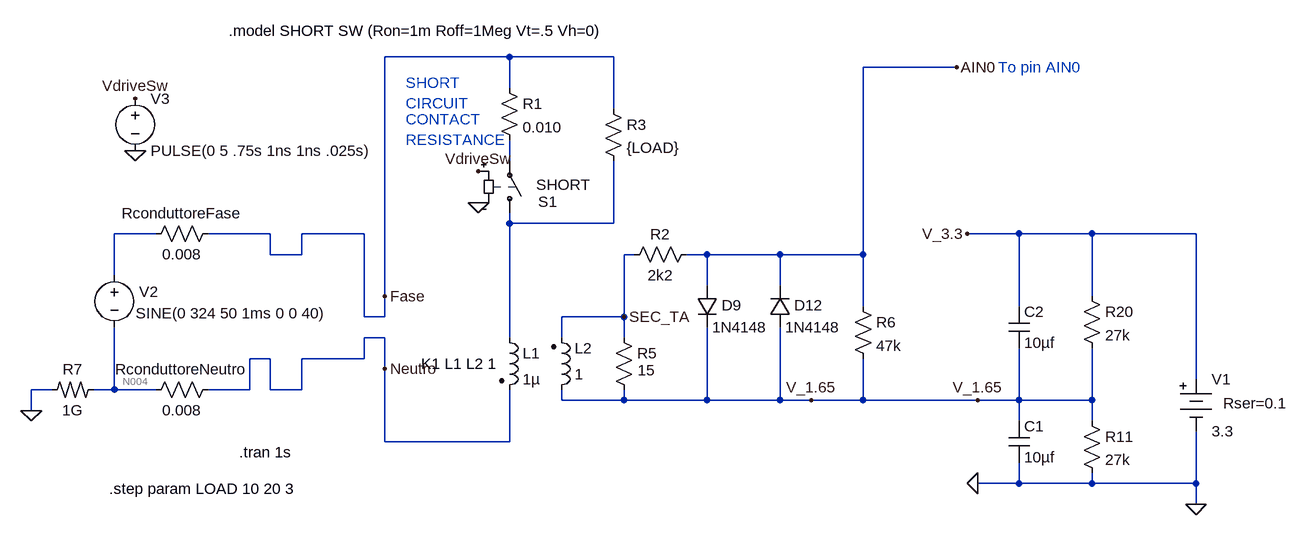
[diagram p0: schematic TrasfCurrentStudio.asc]
TrasfCurrentStudio.asc, the LTspice schematic file:
Version 4
SHEET 1 2288 680
WIRE 528 -464 336 -464
WIRE 688 -464 528 -464
WIRE 1216 -448 1072 -448
WIRE 528 -416 528 -464
WIRE 688 -384 688 -464
WIRE 528 -304 528 -336
WIRE 528 -208 528 -224
WIRE 688 -208 688 -304
WIRE 688 -208 528 -208
WIRE -16 -192 -80 -192
WIRE 160 -192 64 -192
WIRE 304 -192 208 -192
WIRE 1312 -192 1232 -192
WIRE 1424 -192 1312 -192
WIRE 1584 -192 1424 -192
WIRE 160 -160 160 -192
WIRE 208 -160 208 -192
WIRE 208 -160 160 -160
WIRE 720 -160 704 -160
WIRE 832 -160 800 -160
WIRE 944 -160 832 -160
WIRE 1072 -160 1072 -448
WIRE 1072 -160 944 -160
WIRE -80 -128 -80 -192
WIRE 832 -112 832 -160
WIRE 944 -112 944 -160
WIRE 336 -96 336 -464
WIRE 1424 -96 1424 -192
WIRE 1072 -80 1072 -160
WIRE 1312 -80 1312 -192
WIRE 304 -64 304 -192
WIRE 336 -64 336 -96
WIRE 336 -64 304 -64
WIRE 704 -64 704 -160
WIRE 704 -64 608 -64
WIRE 336 -32 304 -32
WIRE 528 -32 528 -208
WIRE 608 -32 608 -64
WIRE 704 -32 704 -64
WIRE 160 0 128 0
WIRE 304 0 304 -32
WIRE 304 0 208 0
WIRE 336 16 336 -32
WIRE 1584 32 1584 -192
WIRE -176 48 -208 48
WIRE -80 48 -80 -48
WIRE -80 48 -112 48
WIRE -16 48 -80 48
WIRE 128 48 128 0
WIRE 128 48 64 48
WIRE 160 48 160 0
WIRE 208 48 208 0
WIRE 208 48 160 48
WIRE 608 64 608 48
WIRE 704 64 704 48
WIRE 704 64 608 64
WIRE 832 64 832 -48
WIRE 832 64 704 64
WIRE 944 64 944 -48
WIRE 944 64 832 64
WIRE 992 64 944 64
WIRE 1072 64 1072 0
WIRE 1072 64 992 64
WIRE 1248 64 1072 64
WIRE 1312 64 1312 -16
WIRE 1312 64 1248 64
WIRE 1424 64 1424 -16
WIRE 1424 64 1312 64
WIRE -208 80 -208 48
WIRE 1312 96 1312 64
WIRE 1424 96 1424 64
WIRE 336 128 336 16
WIRE 528 128 528 48
WIRE 528 128 336 128
WIRE 1312 192 1312 160
WIRE 1312 192 1248 192
WIRE 1424 192 1424 176
WIRE 1424 192 1312 192
WIRE 1584 192 1584 112
WIRE 1584 192 1424 192
WIRE 1584 224 1584 192
FLAG 1232 -192 V_3.3
FLAG -208 80 0
FLAG 1584 224 0
FLAG 1216 -448 AIN0
FLAG 1248 64 V_1.65
FLAG 992 64 V_1.65
FLAG 1248 192 0
FLAG -48 -400 VdriveSw
FLAG -48 -320 0
FLAG 480 -288 VdriveSw
FLAG 480 -240 0
FLAG 336 -96 Fase
FLAG 336 16 Neutro
FLAG 704 -64 SEC_TA
SYMBOL battery 1584 16 R0
WINDOW 123 0 0 Left 0
WINDOW 39 42 53 Left 2
SYMATTR SpiceLine Rser=0.1
SYMATTR InstName V1
SYMATTR Value 3.3
SYMBOL res 688 -48 R0
WINDOW 3 37 66 Left 2
SYMATTR Value 15
SYMATTR InstName R5
SYMBOL ind2 512 -48 R0
SYMATTR InstName L1
SYMATTR Value 1µ
SYMATTR Type ind
SYMATTR SpiceLine Rser=1u
SYMBOL ind2 592 64 M180
WINDOW 0 36 80 Left 2
WINDOW 3 36 40 Left 2
SYMATTR InstName L2
SYMATTR Value 1
SYMATTR Type ind
SYMATTR SpiceLine Rser=47 Cpar=1pF
SYMBOL res2 -112 32 R90
WINDOW 0 0 32 VBottom 2
WINDOW 3 32 32 VTop 2
SYMATTR InstName R7
SYMATTR Value 1G
SYMBOL res 1408 -112 R0
SYMATTR InstName R20
SYMATTR Value 27k
SYMBOL cap 1296 96 R0
SYMATTR InstName C1
SYMATTR Value 10µf
SYMBOL res 816 -176 R90
WINDOW 0 0 56 VBottom 2
WINDOW 3 32 56 VTop 2
SYMATTR InstName R2
SYMATTR Value 2k2
SYMBOL diode 816 -112 R0
WINDOW 0 38 30 Left 2
SYMATTR InstName D9
SYMATTR Value 1N4148
SYMBOL diode 928 -48 M180
WINDOW 0 38 34 Left 2
WINDOW 3 24 0 Left 2
SYMATTR InstName D12
SYMATTR Value 1N4148
SYMBOL res 1408 80 R0
SYMATTR InstName R11
SYMATTR Value 27k
SYMBOL res 512 -432 R0
SYMATTR InstName R1
SYMATTR Value 0.010
SYMBOL voltage -80 -144 R0
WINDOW 123 0 0 Left 0
WINDOW 0 38 41 Left 2
WINDOW 3 33 74 Left 2
SYMATTR SpiceLine Rser=0.01 Cpar=10nF
SYMATTR InstName V2
SYMATTR Value SINE(0 324 50 1ms 0 0 40)
SYMBOL sw 528 -208 M180
WINDOW 0 44 33 Left 2
WINDOW 3 41 59 Left 2
SYMATTR InstName S1
SYMATTR Value SHORT
SYMBOL voltage -48 -416 R0
WINDOW 123 0 0 Left 0
WINDOW 39 0 0 Left 0
SYMATTR InstName V3
SYMATTR Value PULSE(0 5 .75s 1ns 1ns .025s)
SYMBOL res 80 -208 R90
WINDOW 0 0 56 VBottom 2
WINDOW 3 32 56 VTop 2
SYMATTR InstName RconduttoreFase
SYMATTR Value 0.008
SYMBOL res 80 32 R90
WINDOW 0 0 56 VBottom 2
WINDOW 3 32 56 VTop 2
SYMATTR InstName RconduttoreNeutro
SYMATTR Value 0.008
SYMBOL cap 1296 -80 R0
SYMATTR InstName C2
SYMATTR Value 10µf
SYMBOL res 672 -400 R0
SYMATTR InstName R3
SYMATTR Value {LOAD}
SYMBOL res 1056 -96 R0
SYMATTR InstName R6
SYMATTR Value 47k
TEXT 112 144 Left 2 !.tran 1s
TEXT 392 8 Left 2 !K1 L1 L2 1
TEXT 368 -424 Left 2 ;SHORT\nCIRCUIT
TEXT 368 -368 Left 2 ;CONTACT \nRESISTANCE
TEXT 96 -504 Left 2 !.model SHORT SW (Ron=1m Roff=1Meg Vt=.5 Vh=0)
TEXT -88 200 Left 2 !.step param LOAD 10 20 3
TEXT 1280 -448 Left 2 ;To pin AIN0

The netlist it stands for:
* TrasfCurrentStudio.asc
V1 V_3.3 0 3.3 Rser=0.1
R5 SEC_TA V_1.65 15
L1 N002 Neutro 1µ Rser=1u
L2 V_1.65 SEC_TA 1 Rser=47 Cpar=1pF
R7 N004 0 1G
R20 V_3.3 V_1.65 27k
C1 V_1.65 0 10µf
R2 AIN0 SEC_TA 2k2
D9 AIN0 V_1.65 1N4148
D12 V_1.65 AIN0 1N4148
R11 V_1.65 0 27k
R1 Fase N001 0.010
V2 N003 N004 SINE(0 324 50 1ms 0 0 40) Rser=0.01 Cpar=10nF
S1 N002 N001 VdriveSw 0 SHORT
V3 VdriveSw 0 PULSE(0 5 .75s 1ns 1ns .025s)
RconduttoreFase Fase N003 0.008
RconduttoreNeutro Neutro N004 0.008
C2 V_3.3 V_1.65 10µf
R3 Fase N002 {LOAD}
R6 AIN0 V_1.65 47k
.model D D
.lib standard.dio
.tran 1s
K1 L1 L2 1
* SHORT
* CIRCUIT
* CONTACT
* RESISTANCE
.model SHORT SW (Ron=1m Roff=1Meg Vt=.5 Vh=0)
.step param LOAD 10 20 3
* To pin AIN0
.backanno
.end

* Results of the author's LTspice run, read from the files saved beside the schematic
* Operating Point (first step), zero values left out:
*   load = 5 
*   V(v_3.3) = 3.3 V
*   V(sec_ta) = 1.65 V
*   V(v_1.65) = 1.65 V
*   V(ain0) = 1.65 V
*   I(R11) = 61.11 µA
*   I(R20) = 61.11 µA
*   I(V1) = -61.11 µA
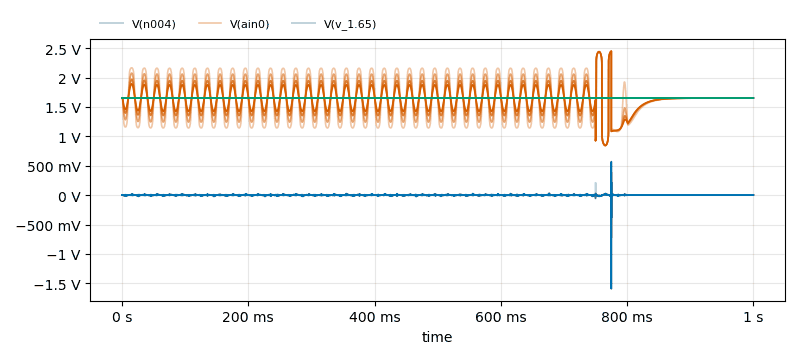
[diagram p1: Transient Analysis of TrasfCurrentStudio.asc, plotted from the saved traces]
* Transient Analysis, 4 runs:
*   V(n004) [load=5]: min -340.3 mV, max 214.9 mV, average -85.01 µV, rms 4.51 mV, last 0 V
*   V(n004) [load=10]: min -717.3 mV, max 402.2 mV, average 58.37 µV, rms 5.106 mV, last 0 V
*   V(n004) [load=15]: min -388.2 mV, max 295.6 mV, average -198.7 µV, rms 4.585 mV, last 0 V
*   V(n004) [load=20]: min -1.594 V, max 569.1 mV, average 132 µV, rms 6.931 mV, last 0 V
*   V(ain0) [load=5]: min 843.6 mV, max 2.447 V, average 1.63 V, rms 1.676 V, last 1.65 V
*   V(ain0) [load=10]: min 843.7 mV, max 2.447 V, average 1.63 V, rms 1.657 V, last 1.65 V
*   V(ain0) [load=15]: min 843.6 mV, max 2.447 V, average 1.63 V, rms 1.647 V, last 1.65 V
*   V(ain0) [load=20]: min 843.7 mV, max 2.447 V, average 1.63 V, rms 1.643 V, last 1.65 V
*   V(v_1.65) [load=5]: min 1.65 V, max 1.65 V, average 1.65 V, rms 1.65 V, last 1.65 V
*   V(v_1.65) [load=10]: min 1.65 V, max 1.65 V, average 1.65 V, rms 1.65 V, last 1.65 V
*   V(v_1.65) [load=15]: min 1.65 V, max 1.65 V, average 1.65 V, rms 1.65 V, last 1.65 V
*   V(v_1.65) [load=20]: min 1.65 V, max 1.65 V, average 1.65 V, rms 1.65 V, last 1.65 V